# EAGLE design ParkingSensor (EAGLE 9.6.2)
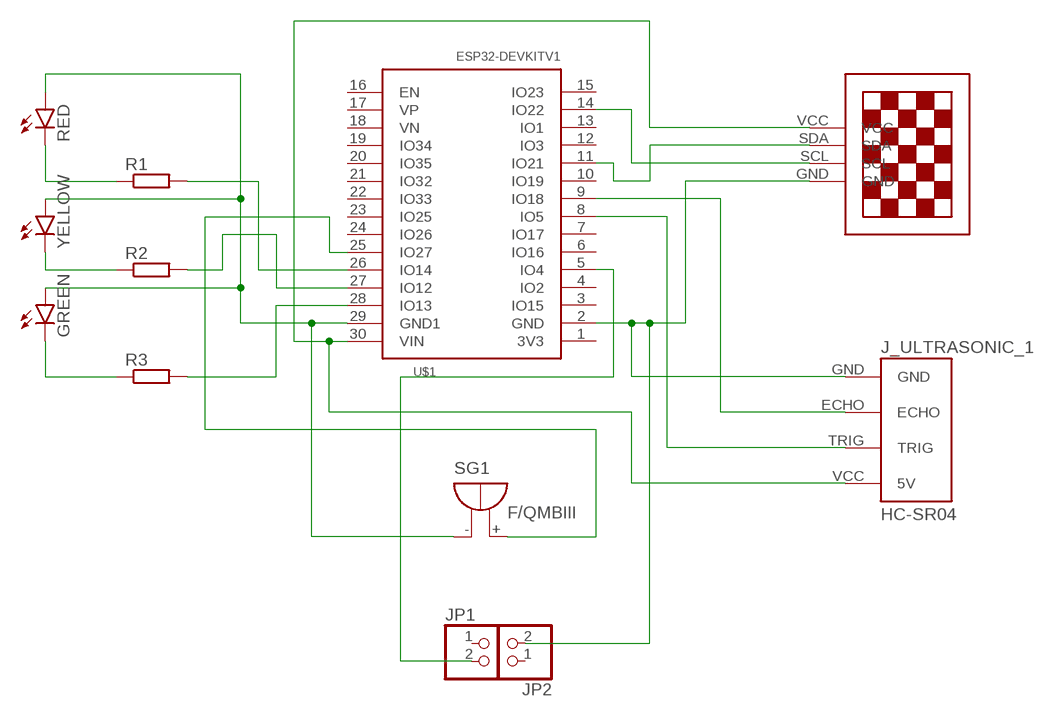
[diagram p0: schematic, sheet 1]

## Parts
GREEN  LED5MM  [LED5MM]
J_ULTRASONIC_1  HC-SR04  [HC-SR04_FOOTPRINT]
JP1  PINHD-1X2  [1X02]
JP2  PINHD-1X2  [1X02]
R1  R-EU_0204/7  [0204/7]
R2  R-EU_0204/7  [0204/7]
R3  R-EU_0204/7  [0204/7]
RED  LED5MM  [LED5MM]
SG1  F/QMBIII  [F/QMBIII]
U$1  ESP32DEVKITV1  [ESP32-DEVKITV1]
U$3  13"OLED13"OLED  [1.3"OLED]
YELLOW  LED5MM  [LED5MM]

## Nets
N$1: J_ULTRASONIC_1.GND JP2.2 U$1.2(GND) U$3.GND
N$2: J_ULTRASONIC_1.VCC(5V) U$1.30(VIN) U$3.VCC
N$3: U$1.14(IO22) U$3.SCL
N$4: U$1.11(IO21) U$3.SDA
N$5: SG1.+(-) U$1.25(IO27)
N$6: J_ULTRASONIC_1.TRIG U$1.8(IO5)
N$7: J_ULTRASONIC_1.ECHO U$1.9(IO18)
N$8: GREEN.K(C) R3.1
N$9: R2.1 YELLOW.K(C)
N$10: R1.1 RED.K(C)
N$11: R1.2 U$1.26(IO14)
N$12: R2.2 U$1.27(IO12)
N$13: R3.2 U$1.28(IO13)
N$14: GREEN.A RED.A SG1.-(+) U$1.29(GND1) YELLOW.A
N$15: JP1.2 U$1.5(IO4)
Unconnected: JP1.1 JP2.1 U$1.1(3V3) U$1.3(IO15) U$1.4(IO2) U$1.6(IO16) U$1.7(IO17) U$1.10(IO19) U$1.12(IO3) U$1.13(IO1) U$1.15(IO23) U$1.16(EN) U$1.17(VP) U$1.18(VN) U$1.19(IO34) U$1.20(IO35) U$1.21(IO32) U$1.22(IO33) U$1.23(IO25) U$1.24(IO26)

## Library data of the parts
GREEN RED YELLOW = led:LED: LED OSRAM: - CHIPLED LG R971, LG N971, LY N971, LG Q971, LY Q971, LO R971, LY R971 LH N974, LH R974 LS Q976, LO Q976, LY Q976 LO Q996 - Hyper CHIPLED LW Q18S LB Q993, LB Q99A, LB R99A - SideLED LS A670, LO A670, LY A670, LG A670, LP A670 LB A673, LV A673, LT A673, LW A673 LH A674 LY A675 LS A676, LA A676, LO A676, LY A676, LW A676 LS A679, LY A679, LG A679 - Hyper Micro SIDELED® LS Y876, LA Y876, LO Y876, LY Y876 LT Y87S - SmartLED LW L88C, LW L88S LB L89C, LB L89S, LG L890 LS L89K, LO L89K, LY L89K LS L896, LA L896, LO L896, LY L896 - TOPLED LS T670, LO T670, LY T670, LG T670, LP T670 LSG T670, LSP T670, LSY T670, LOP T670, LYG T670 LG T671, LOG T671, LSG T671 LB T673, LV T673, LT T673, LW T673 LH T674 LS T676, LA T676, LO T676, LY T676, LB T676, LH T676, LSB T676, LW T676 LB T67C, LV T67C, LT T67C, LS T67K, LO T67K, LY T67K, LW E67C LS E67B, LA E67B, LO E67B, LY E67B, LB E67C, LV E67C, LT E67C LW T67C LS T679, LY T679, LG T679 LS T770, LO T770, LY T770, LG T770, LP T770 LB T773, LV T773, LT T773, LW T773 LH T774 LS E675, LA E675, LY E675, LS T675 LS T776, LA T776, LO T776, LY T776, LB T776 LHGB T686 LT T68C, LB T68C - Hyper Mini TOPLED® LB M676 - Mini TOPLED Santana® LG M470 LS M47K, LO M47K, LY M47K Source: http://www.osram.convergy.de LUXEON: - LUMILED® LXK2-PW12-R00, LXK2-PW12-S00, LXK2-PW14-U00, LXK2-PW14-V00 LXK2-PM12-R00, LXK2-PM12-S00, LXK2-PM14-U00 LXK2-PE12-Q00, LXK2-PE12-R00, LXK2-PE12-S00, LXK2-PE14-T00, LXK2-PE14-U00 LXK2-PB12-K00, LXK2-PB12-L00, LXK2-PB12-M00, LXK2-PB14-N00, LXK2-PB14-P00, LXK2-PB14-Q00 LXK2-PR12-L00, LXK2-PR12-M00, LXK2-PR14-Q00, LXK2-PR14-R00 LXK2-PD12-Q00, LXK2-PD12-R00, LXK2-PD12-S00 LXK2-PH12-R00, LXK2-PH12-S00 LXK2-PL12-P00, LXK2-PL12-Q00, LXK2-PL12-R00 Source: www.luxeon.com KINGBRIGHT: KA-3528ASYC Source: www.kingbright.com
J_ULTRASONIC_1 = Ultrasonic Sensor HC-SR04:HC-SR04: Ultrasonic Sensor HC-SR04
JP1 JP2 = pinhead:PINHD-1X2: PIN HEADER
R1-R3 = rcl:R-EU_: RESISTOR, European symbol; SPICEPREFIX: R
SG1 = buzzer:F/QMBIII: BUZZER Source: Buerklin; OC_FARNELL: unknown; OC_NEWARK: unknown
U$1 = ESP32-DEVKITV1:ESP32DEVKITV1
U$3 = 13oled:13"OLED

## Board
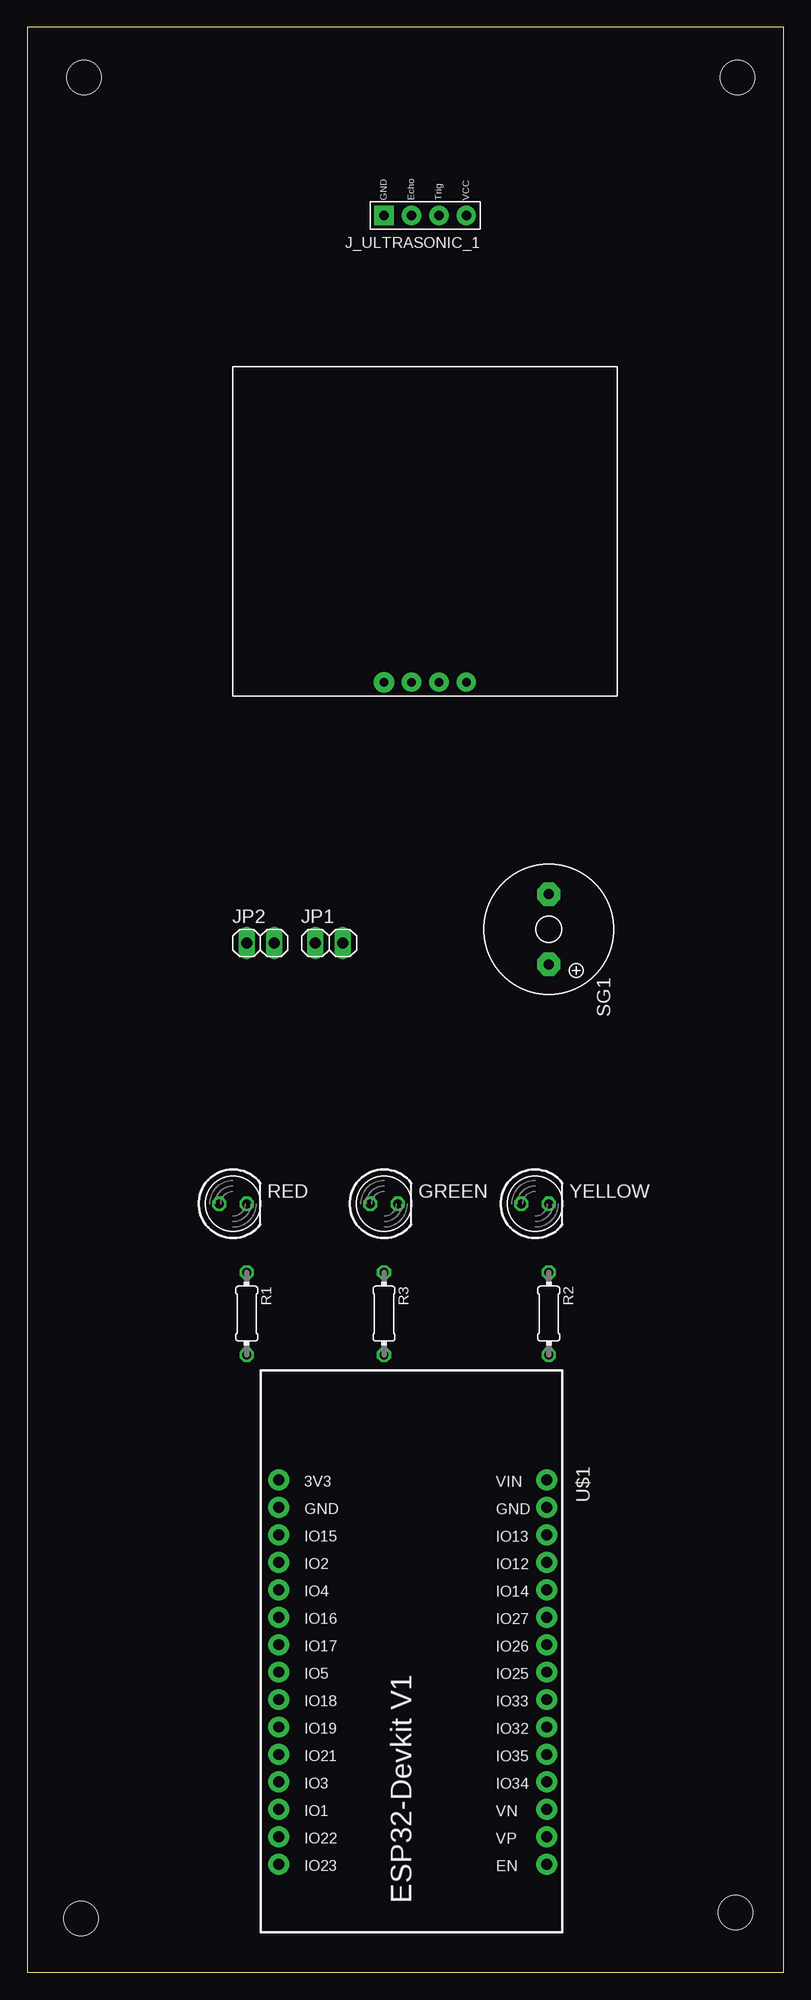
[diagram p1: board, top side]
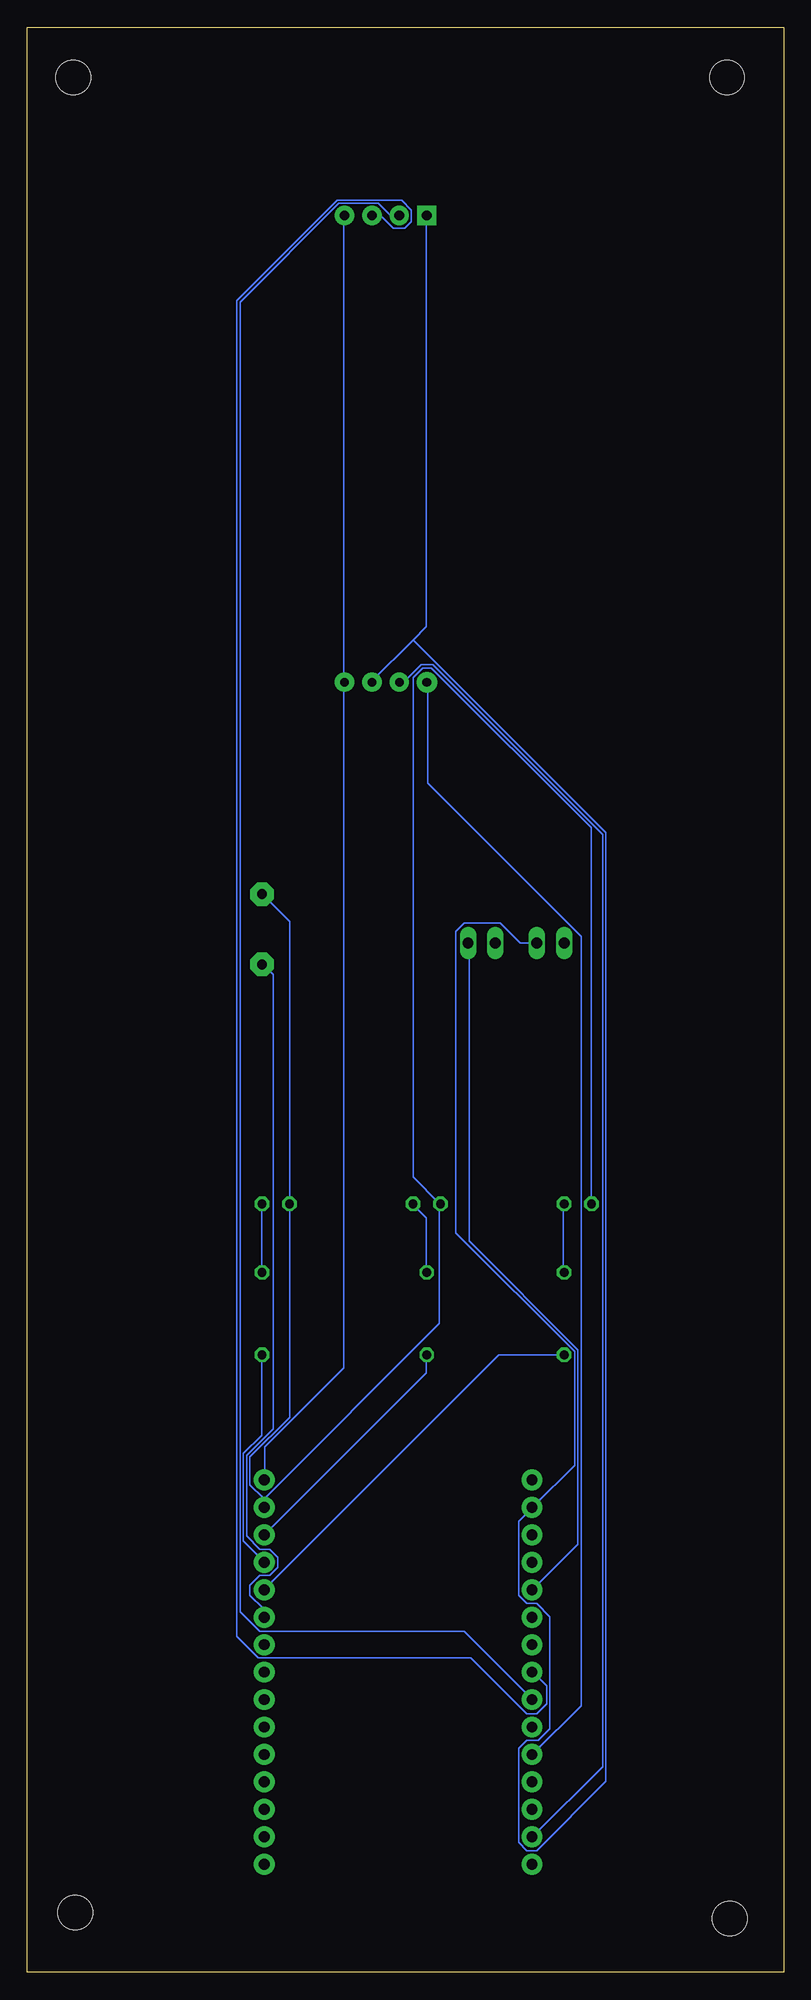
[diagram p2: board, bottom side, seen from below]

Size 70 x 180 mm. Coordinates in mm from the lower left corner, seen from the top.
Outline: 0,0 70,0 70,180 0,180 0,0
Copper layers (1*16): Top 0.035mm / dielectric 1.5mm / Bottom 0.035mm
Design rules "default": minimum track width 6mil, minimum drill 0.35mm, track to track 6mil, track to pad 6mil, pad to pad 6mil, via to via 6mil, smd to smd 6mil, copper to edge 40mil, drill to drill 6mil, minimum pad ring 10mil, minimum via ring 8mil, stop-mask expansion 4mil, vias tented up to drill 0mil, thermal gap 10mil
Holes 3.2 mm at 5,5 65.54,5.54 65.72,175.34 5.26,175.34

### Footprints (pad centres in the part's own frame; a part is rotated, then mirrored left to right if it is on the bottom)
LED5MM = drill 0.813 octagon: A -1.27,0; K 1.27,0
HC-SR04_FOOTPRINT = drill 0.9 pad 1.778: ECHO 0,1.27; TRIG 0,-1.27; VCC 0,-3.81 | drill 0.9 pad 1.778 square: GND 0,3.81
1X02 = drill 1.016 long: 1 -1.27,0; 2 1.27,0
0204/7 = drill 0.813 octagon: 1 -3.81,0; 2 3.81,0
F/QMBIII = drill 0.914 pad 2.159 octagon: + 3.251,0; - -3.251,0
ESP32-DEVKITV1 = drill 1 pad 1.93: 1 -22.87,-13.54; 2 -20.33,-13.54; 3 -17.79,-13.54; 4 -15.25,-13.54; 5 -12.71,-13.54; 6 -10.17,-13.54; 7 -7.63,-13.54; 8 -5.09,-13.54; 9 -2.55,-13.54; 10 -0.01,-13.54; 11 2.53,-13.54; 12 5.07,-13.54; 13 7.61,-13.54; 14 10.15,-13.54; 15 12.69,-13.54; 16 12.69,11.23; 17 10.15,11.23; 18 7.61,11.23; 19 5.07,11.23; 20 2.53,11.23; 21 -0.01,11.23; 22 -2.55,11.23; 23 -5.09,11.23; 24 -7.63,11.23; 25 -10.17,11.23; 26 -12.71,11.23; 27 -15.25,11.23; 28 -17.79,11.23; 29 -20.33,11.23; 30 -22.87,11.23
1.3"OLED = drill 0.8 pad 1.778: GND 2.54,0; SCL 5.08,0; VCC 0,0 | drill 0.8 pad 1.9: SDA 7.62,0

### Placement (x,y rotation side)
GREEN  33.02,71.12 0 top
J_ULTRASONIC_1  36.83,162.56 90 top
JP1  27.94,95.25 0 top
JP2  21.59,95.25 0 top
R1  20.32,60.96 270 top
R2  48.26,60.96 270 top
R3  33.02,60.96 270 top
RED  19.05,71.12 0 top
SG1  48.26,96.52 270 top
U$1  36.83,22.7 270 top
U$3  40.64,119.38 180 top
YELLOW  46.99,71.12 0 top

### Tracks (layer width: path | path; a pad name or v marks a point on that pad's centre or on a via)
N$1
  Bottom 0.152: 34.29,123.29 38.1,119.48 U$3.GND | 34.29,123.29 33.07,124.51 33.07,162.46 J_ULTRASONIC_1.GND | JP2.2 24.38,95.25 26.21,97.08 29.57,97.08 30.33,96.32 30.33,68.43 19.36,57.45 19.36,46.94 23.16,43.13 U$1.2 23.32,42.98 24.54,41.76 24.54,34.9 23.77,34.14 22.86,34.14 21.64,32.92 21.64,22.55 22.71,21.49 23.77,21.49 24.54,20.73 24.54,12.04 23.77,11.28 22.86,11.28 16.46,17.68 16.46,105.46 34.29,123.29
N$2
  Bottom 0.152: J_ULTRASONIC_1.VCC 40.69,162.46 40.69,119.48 U$3.VCC 40.69,119.33 40.69,55.93 48.01,48.62 48.01,45.72 U$1.30
N$3
  Bottom 0.152: U$3.SCL 35.51,119.48 35.05,119.48 33.53,121.01 32.46,121.01 16.76,105.31 16.76,19.05 23.16,12.65 U$1.14
N$4
  Bottom 0.152: U$3.SDA 32.92,119.33 32.92,110.03 18.75,95.86 18.75,24.69 23.16,20.27 U$1.11
N$5
  Bottom 0.152: U$1.25 48.16,32.92 48.16,33.68 49.38,34.9 49.38,35.81 48.46,36.73 47.55,36.73 46.79,37.49 46.79,38.41 47.55,39.17 48.46,39.17 49.68,40.39 49.68,47.85 47.24,50.29 47.24,92.35 48.16,93.27 SG1.+
N$6
  Bottom 0.152: J_ULTRASONIC_1.TRIG 38.1,162.46 37.19,162.46 36.12,161.39 35.05,161.39 34.44,162 34.44,163.07 35.36,163.98 41.3,163.98 50.6,154.69 50.6,31.09 48.62,29.11 28.96,29.11 23.77,23.93 22.86,23.93 21.95,24.84 21.95,26.52 23.16,27.74 U$1.8
N$7
  Bottom 0.152: J_ULTRASONIC_1.ECHO 35.66,162.61 36.42,162.61 37.49,163.68 41.15,163.68 50.29,154.53 50.29,33.38 48.46,31.55 29.57,31.55 23.32,25.3 U$1.9
N$8
  Bottom 0.152: R3.1 33.07,64.77 33.07,69.8 34.29,71.02 GREEN.K
N$9
  Bottom 0.152: R2.1 48.31,64.77 48.31,71.02 YELLOW.K
N$10
  Bottom 0.152: R1.1 20.42,64.77 20.42,71.02 RED.K
N$11
  Bottom 0.152: R1.2 26.36,57.15 48.01,35.51 U$1.26
N$12
  Bottom 0.152: R2.2 48.31,57.15 48.31,49.68 49.99,48.01 49.99,39.93 48.16,38.1 U$1.27
N$13
  Bottom 0.152: R3.2 33.07,57.15 33.07,55.47 48.01,40.54 U$1.28
N$14
  Bottom 0.152: RED.A 17.83,71.17 17.83,105.92 32.61,120.7 33.38,120.7 34.29,119.79 34.29,73.61 31.85,71.17 GREEN.A 31.85,71.02 31.85,60.05 48.16,43.74 | SG1.- 45.72,97.23 YELLOW.A 45.72,51.36 49.38,47.7 49.38,45.11 48.16,43.89 48.16,43.74 | 48.16,43.74 48.16,43.13 U$1.29 48.16,43.74
N$15
  Bottom 0.152: JP1.2 29.11,95.25 29.11,67.67 19.05,57.61 19.05,39.62 23.16,35.51 U$1.5